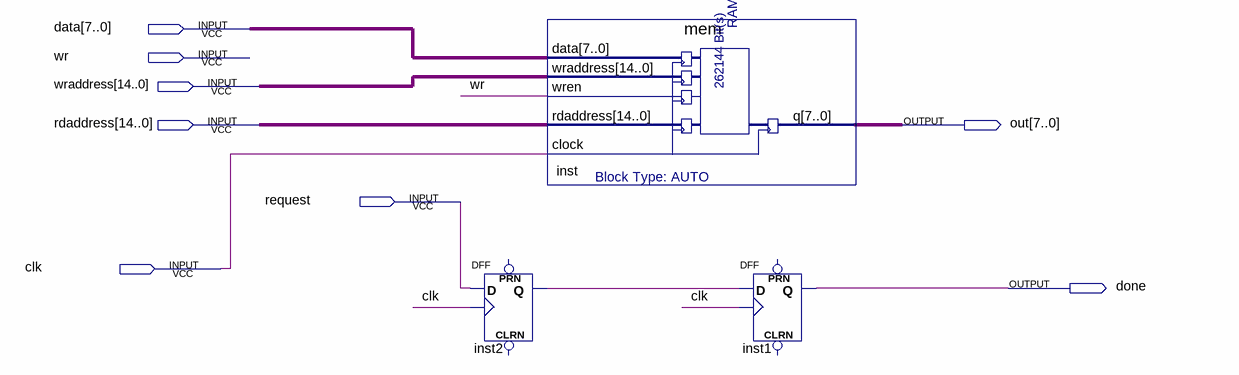
[diagram p0: schematic sheet]
// Quartus schematic GPURAM.bdf as structural Verilog: 3 symbols, 8 pins
module GPURAM (
  input  [7:0] data,
  input  wr,
  input  [14:0] wraddress,
  input  [14:0] rdaddress,
  input  request,
  input  clk,
  output [7:0] out,
  output done
);

  wire inst2_q;

  DFF inst2 (.CLK(clk), .D(request), .Q(inst2_q));  // open: CLRN, PRN
  mem inst (.data(data), .wraddress(wraddress), .wren(wr), .rdaddress(rdaddress), .clock(clk), .q(out));
  DFF inst1 (.CLK(clk), .D(inst2_q), .Q(done));  // open: CLRN, PRN
endmodule
